# EAGLE design Feather (EAGLE 6.4)
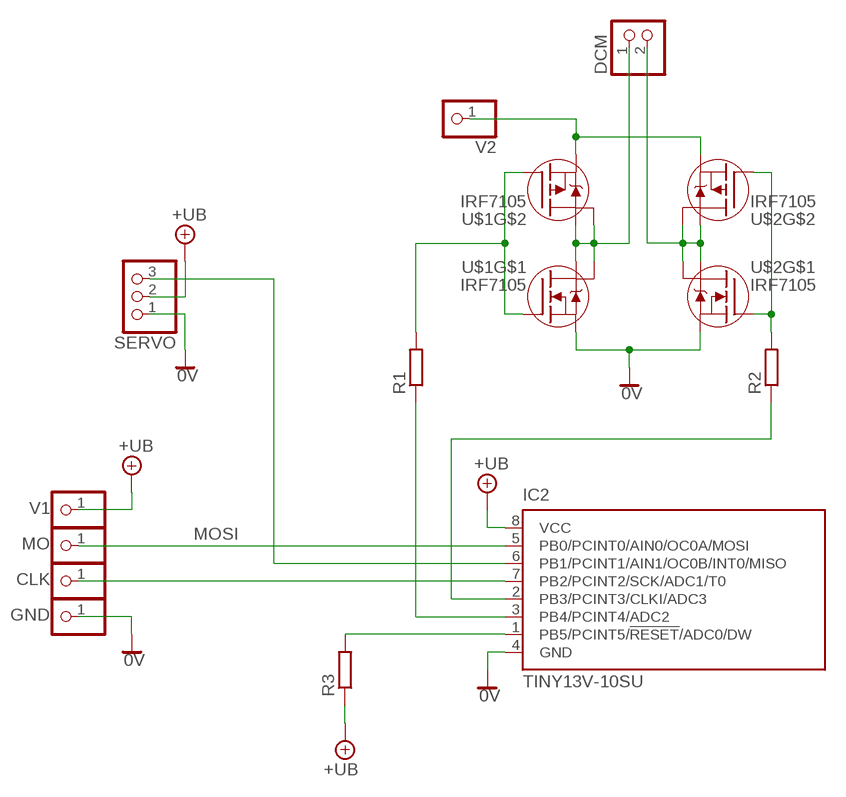
[diagram p0: schematic, sheet 1]

## Parts
CLK  PINHD-1X1  [1X01]
DCM  PINHD-1X2  [1X02]
GND  PINHD-1X1  [1X01]
IC2  TINY13V-10SU  [8S2]
MO  PINHD-1X1  [1X01]
R1  R-EU_R1206  [R1206]
R2  R-EU_R1206  [R1206]
R3  R-EU_R1206  [R1206]
SERVO  PINHD-1X3  [1X03]
U$1  IRF7105  [SO8-2]
U$2  IRF7105  [SO8-2]
V1  PINHD-1X1  [1X01]
V2  PINHD-1X1  [1X01]

## Nets
0V: GND.1 IC2.4(GND) SERVO.1 U$1.1(S) U$2.1(S)
+UB: IC2.8(VCC) R3.1 SERVO.2 V1.1
MOSI: IC2.5(PB0/PCINT0/AIN0/OC0A/MOSI) MO.1
N$1: DCM.1 U$1.5(D) U$1.6(D) U$1.7(D) U$1.8(D)
N$2: IC2.3(PB4/PCINT4/ADC2) R1.1
N$3: R2.2 U$2.2(G) U$2.4(G)
N$4: DCM.2 U$2.5(D) U$2.6(D) U$2.7(D) U$2.8(D)
N$5: IC2.2(PB3/PCINT3/CLKI/ADC3) R2.1
N$6: R1.2 U$1.2(G) U$1.4(G)
N$7: IC2.1(PB5/PCINT5/!RESET!/ADC0/DW) R3.2
N$8: CLK.1 IC2.7(PB2/PCINT2/SCK/ADC1/T0)
N$9: U$1.3(S) U$2.3(S) V2.1
N$11: IC2.6(PB1/PCINT1/AIN1/OC0B/INT0/MISO) SERVO.3

## Library data of the parts
CLK GND MO V1 V2 = pinhead:PINHD-1X1: PIN HEADER
DCM = pinhead:PINHD-1X2: PIN HEADER
IC2 = atmel:TINY13: 8-bit AVR Microcontroller with 1K Bytes In-System Programmable Flash Source: http://www.atmel.com/dyn/resources/prod_documents/2535S.pdf; MPN: ATTINY13V-10SU; OC_FARNELL: 9171584; OC_NEWARK: 96K6524
R1-R3 = rcl:R-EU_: RESISTOR, European symbol
SERVO = pinhead:PINHD-1X3: PIN HEADER
U$1 U$2 = irf-2:IRF7105: HEXFET® Power MOSFET Adavanced Process Technology Ultra Low On-Resistance Dual N and P Channel MOSFET Surface Mount Available in Tape & Reel Dynamic dv/dt Rating Fast Switching Please connect both Drain-Pins of each FET for thermal Reasons! (Pin 5 with Pin 6, 7 with 8)

## Board
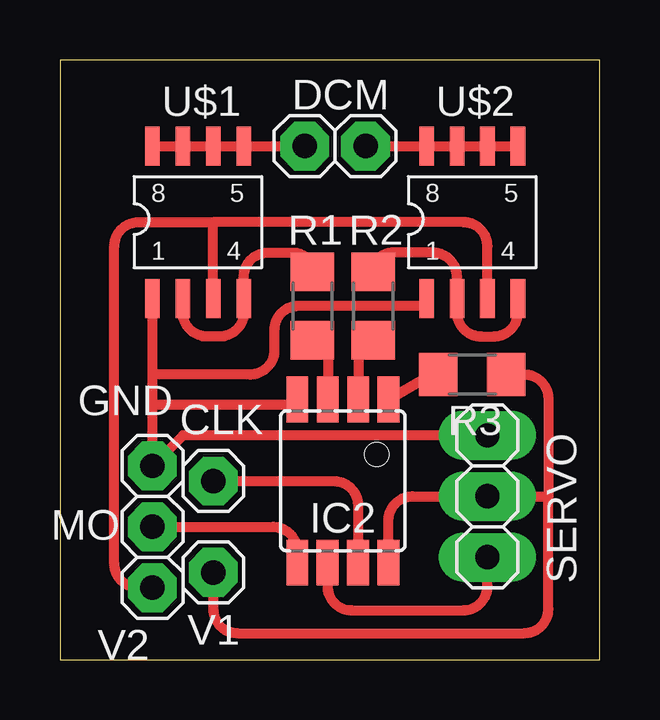
[diagram p1: board, top side]

Size 22.5 x 25 mm. Coordinates in mm from the lower left corner, seen from the top.
Outline: 0,0 22.5,0 22.5,25 0,25 0,0
Copper layers (1*16): Top 0.035mm / dielectric 1.5mm / Bottom 0.035mm
Design rules "default": minimum track width 12mil, minimum drill 20mil, track to track 12mil, track to pad 12mil, pad to pad 12mil, via to via 12mil, smd to smd 12mil, copper to edge 30mil, drill to drill 40mil, minimum pad ring 20mil, minimum via ring 12mil, stop-mask expansion 8mil, vias tented up to drill 0mil, thermal gap 10mil

### Footprints (pad centres in the part's own frame; a part is rotated, then mirrored left to right if it is on the bottom)
1X01 = drill 1.016 octagon: 1 0,0
1X02 = drill 1.016 pad 1.778 octagon: 1 -1.27,0; 2 1.27,0
8S2 = smd 0.9 x 1.9: 1 -1.905,-3.404; 2 -0.645,-3.404; 3 0.625,-3.404; 4 1.895,-3.404; 5 1.905,3.404; 6 0.635,3.404; 7 -0.635,3.404; 8 -1.905,3.404
R1206 = smd 1.6 x 1.803: 1 -1.422,0; 2 1.422,0
1X03 = drill 1.016 long: 1 -2.54,0; 2 0,0; 3 2.54,0
SO8-2 = smd 0.61 x 1.626: 1 -2.54,-2.54; 2 -1.27,-2.54; 3 0,-2.54; 4 1.27,-2.54; 5 1.27,3.81; 6 0,3.81; 7 -1.27,3.81; 8 -2.54,3.81

### Placement (x,y rotation side)
CLK  6.39,7.44 0 top
DCM  11.47,21.41 0 top
GND  3.86,8.07 0 top
IC2  11.79,7.44 180 top
MO  3.86,5.54 0 top
R1  10.52,14.74 90 top
R2  13.06,14.74 90 top
R3  17.19,11.88 180 top
SERVO  17.82,6.8 270 top
U$1  6.39,17.6 0 top
U$2  17.82,17.6 0 top
V1  6.39,3.63 0 top
V2  3.86,3 0 top

### Tracks (layer width: path | path; a pad name or v marks a point on that pad's centre or on a via)
0V
  Top 0.406: U$2.1 15.29,14.74 9.94,14.74 arc90 8.94,13.74 8.94,12.88 arc-90 7.94,11.88 3.86,11.88 | 3.86,10.6 3.88,10.62 9.9,10.62 IC2.4 | SERVO.1 5.12,9.35 GND.1 3.86,10.6 | 3.86,10.6 3.86,11.88 | 3.86,11.88 U$1.1
+UB
  Top 0.406: 20.37,6.8 20.37,2.1 arc-90 19.37,1.1 7.39,1.1 arc-90 6.39,2.1 V1.1 | R3.1 19.37,11.88 arc-90 20.37,10.88 20.37,6.8 | 20.37,6.8 SERVO.2 14.7,6.8 arc90 13.7,5.8 IC2.8
MOSI
  Top 0.406: MO.1 8.89,5.54 arc-90 9.89,4.54 IC2.5
N$1
  Top 0.406: U$1.8 U$1.7 U$1.6 U$1.5 DCM.1
N$2
  Top 0.406: R1.1 11.17,13.32 IC2.3
N$3
  Top 0.406: 19.09,14.74 U$2.4 19.09,14.47 arc-90 18.09,13.47 17.55,13.47 arc-90 16.55,14.47 U$2.2 16.55,15.96 arc90 15.55,16.96 13.86,16.96 arc90 R2.2
N$4
  Top 0.406: DCM.2 U$2.8 U$2.7 U$2.6 U$2.5
N$5
  Top 0.406: R2.1 12.44,13.32 IC2.2
N$6
  Top 0.406: U$1.2 5.12,14.47 arc90 6.12,13.47 6.67,13.47 arc90 7.67,14.47 U$1.4 7.67,15.96 arc-90 8.66,16.96 9.72,16.96 arc-90 R1.2
N$7
  Top 0.406: IC2.1 15.49,11.88 R3.2
N$8
  Top 0.406: CLK.1 11.43,7.44 arc-90 12.43,6.44 IC2.7
N$9
  Top 0.406: U$1.3 6.39,18.23 | U$2.3 17.82,17.23 arc90 16.82,18.23 6.39,18.23 | 6.39,18.23 3.27,18.23 arc90 2.27,17.23 2.27,4 arc90 3.27,3 V2.1
N$11
  Top 0.406: SERVO.3 17.82,3.05 arc-90 16.82,2.05 12.16,2.05 arc-90 11.16,3.05 IC2.6